# Altium schematic sheet Level Shifting & Connectors.SchDoc
size A4; SheetNumber: 4; SheetTotal: 9
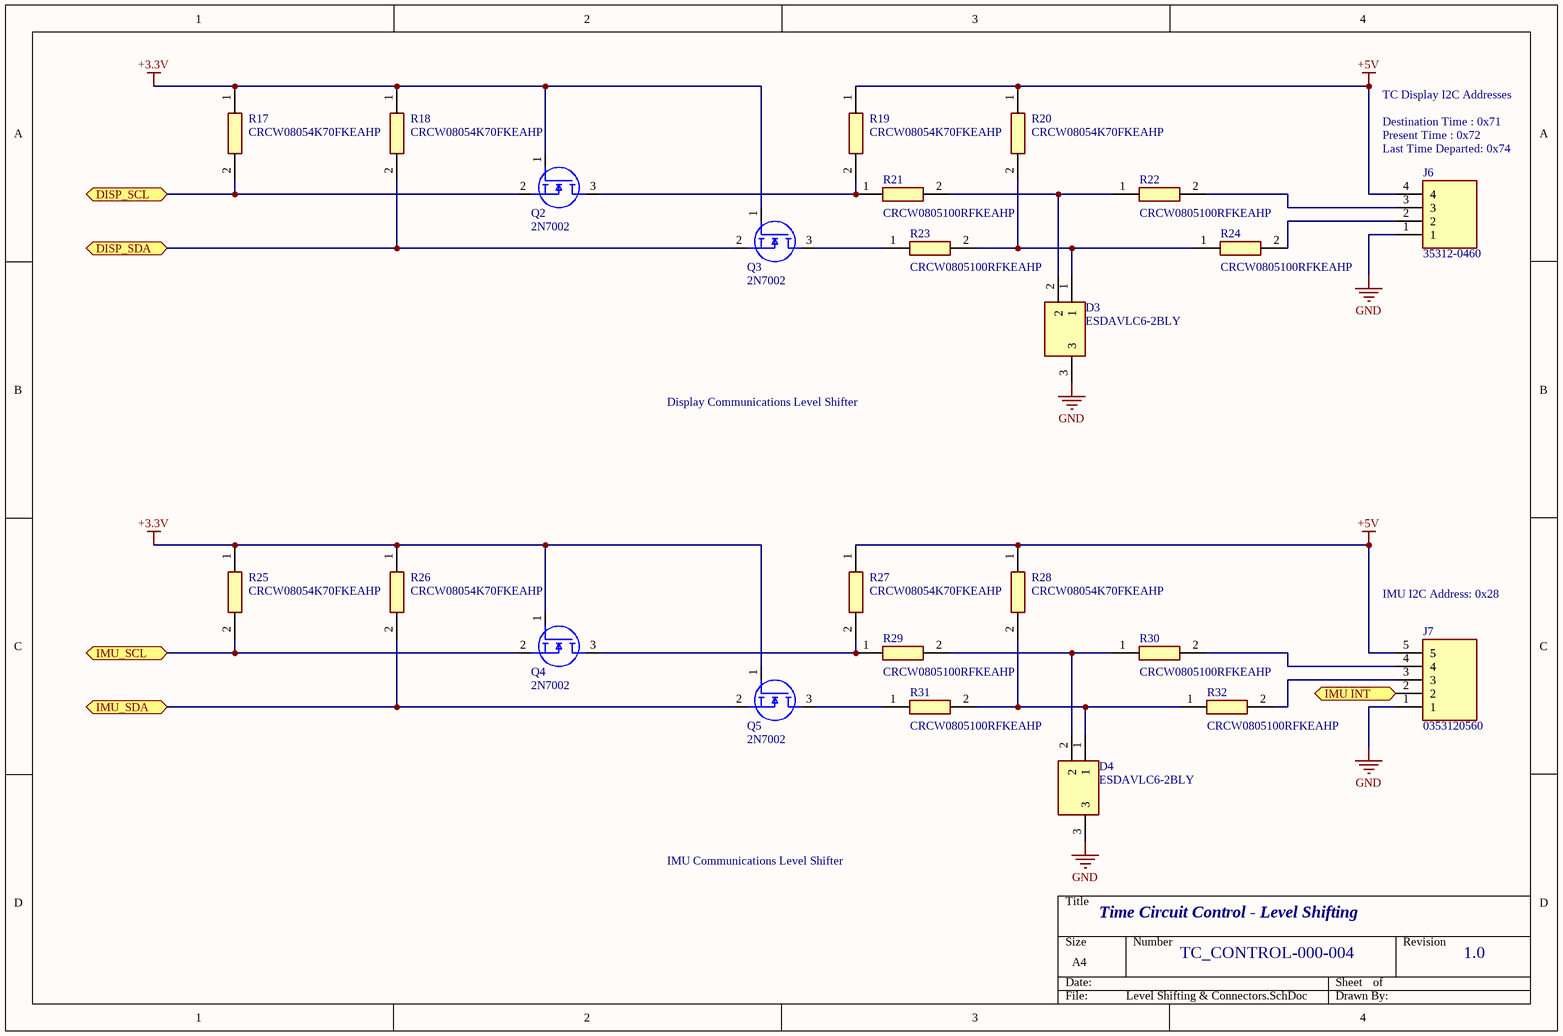
[diagram p0: Level Shifting & Connectors.SchDoc]

## Parts
D3  ESDAVLC6-2BLY  [SOT95P255X150-3N]
D4  ESDAVLC6-2BLY  [SOT95P255X150-3N]
J6  35312-0460  [SHDR4W64P0X250_1X4_1246X650X700P]
J7  0353120560  [0353120560]
Q2  2N7002  [SOT96P240X120-3N]
Q3  2N7002  [SOT96P240X120-3N]
Q4  2N7002  [SOT96P240X120-3N]
Q5  2N7002  [SOT96P240X120-3N]
R17  CRCW08054K70FKEAHP  [RESC2012X50N]
R18  CRCW08054K70FKEAHP  [RESC2012X50N]
R19  CRCW08054K70FKEAHP  [RESC2012X50N]
R20  CRCW08054K70FKEAHP  [RESC2012X50N]
R21  CRCW0805100RFKEAHP  [RESC2012X50N]
R22  CRCW0805100RFKEAHP  [RESC2012X50N]
R23  CRCW0805100RFKEAHP  [RESC2012X50N]
R24  CRCW0805100RFKEAHP  [RESC2012X50N]
R25  CRCW08054K70FKEAHP  [RESC2012X50N]
R26  CRCW08054K70FKEAHP  [RESC2012X50N]
R27  CRCW08054K70FKEAHP  [RESC2012X50N]
R28  CRCW08054K70FKEAHP  [RESC2012X50N]
R29  CRCW0805100RFKEAHP  [RESC2012X50N]
R30  CRCW0805100RFKEAHP  [RESC2012X50N]
R31  CRCW0805100RFKEAHP  [RESC2012X50N]
R32  CRCW0805100RFKEAHP  [RESC2012X50N]

## Ports
DISP_SCL, DISP_SDA, IMU INT, IMU_SCL, IMU_SDA

## Nets
+3.3V: Q2.1(G) Q3.1(G) Q4.1(G) Q5.1(G) R17.1 R18.1 R25.1 R26.1
+5V: J6.4 J7.5 R19.1 R20.1 R27.1 R28.1
GND: D3.3 D4.3 J6.1 J7.1
DISP_SCL: Q2.2(S) R17.2 ; port DISP_SCL
DISP_SDA: Q3.2(S) R18.2 ; port DISP_SDA
IMU INT: J7.2 ; port IMU INT
IMU_SCL: Q4.2(S) R25.2 ; port IMU_SCL
IMU_SDA: Q5.2(S) R26.2 ; port IMU_SDA
NetD3_1: D3.1 R20.2 R23.2 R24.1
NetD3_2: D3.2 R21.2 R22.1
NetD4_1: D4.1 R28.2 R31.2 R32.1
NetD4_2: D4.2 R29.2 R30.1
NetJ6_2: J6.2 R24.2
NetJ6_3: J6.3 R22.2
NetJ7_3: J7.3 R32.2
NetJ7_4: J7.4 R30.2
NetQ2_3: Q2.3(D) R19.2 R21.1
NetQ3_3: Q3.3(D) R23.1
NetQ4_3: Q4.3(D) R27.2 R29.1
NetQ5_3: Q5.3(D) R31.1

## Notes on the sheet
- (near J6) TC Display I2C Addresses
  Destination Time : 0x71
  Present Time : 0x72
  Last Time Departed: 0x74
- Display Communications Level Shifter
- IMU I2C Address: 0x28
- IMU Communications Level Shifter
- Time Circuit Control - Level Shifting
- TC_CONTROL-000-004
- 1.0

## Library data of the parts
D3 D4 = ESDAVLC6-2BLY: TVS Diode (Bi-directional); Manufacturer_Name: STMicroelectronics; Datasheet Link: http://www.st.com/resource/en/datasheet/esdavlc6-2bly.pdf; Height: 1.5mm; Manufacturer_Part_Number: ESDAVLC6-2BLY; Mouser Part Number: 511-ESDAVLC6-2BLY; Mouser Price/Stock: https://www.mouser.co.uk/ProductDetail/STMicroelectronics/ESDAVLC6-2BLY?qs=l7cgNqFNU1iH2e21evvYsA%3D%3D; Arrow Part Number: ESDAVLC6-2BLY; Arrow Price/Stock: https://www.arrow.com/en/products/esdavlc6-2bly/stmicroelectronics
J6 = 35312-0460: Connector; Manufacturer_Name: Molex; Datasheet Link: https://www.molex.com/pdm_docs/sd/353120460_sd.pdf; Height: 7mm; Manufacturer_Part_Number: 35312-0460; Mouser Part Number: 538-35312-0460; Mouser Price/Stock: https://www.mouser.co.uk/ProductDetail/Molex/35312-0460?qs=K5bGVUuM57oIWvCwIBpyrQ%3D%3D
J7 = 0353120560: Connector; Manufacturer_Name: Molex; Datasheet Link: https://www.molex.com/molex/products/part-detail/pcb_headers/0353120560; Height: 7mm; Manufacturer_Part_Number: 0353120560; Mouser Part Number: N/A; Mouser Price/Stock: https://www.mouser.com/Search/Refine.aspx?Keyword=N%2FA; Arrow Part Number: 0353120560; Arrow Price/Stock: https://www.arrow.com/en/products/0353120560/molex
Q2-Q5 = 2N7002: MOSFET (N-Channel); Manufacturer_Name: Vishay; Datasheet Link: https://www.diodes.com/assets/Datasheets/ds11303.pdf; Height: 1.2mm; Manufacturer_Part_Number: 2N7002; Mouser Part Number: 781-2N7002; Mouser Price/Stock: https://www.mouser.co.uk/ProductDetail/Vishay-Siliconix/2N7002?qs=xBpwZ0JX2zKeuvZKtdYLZQ%3D%3D
R17-R20 R25-R28 = CRCW08054K70FKEAHP: Resistor; Manufacturer_Name: Vishay; Datasheet Link: http://uk.rs-online.com/web/p/products/8123574; Height: 0.5mm; Manufacturer_Part_Number: CRCW08054K70FKEAHP; Arrow Part Number: CRCW08054K70FKEAHP; Arrow Price/Stock: https://www.arrow.com/en/products/crcw08054k70fkeahp/vishay; Mouser Part Number: 71-CRCW08054K70FKEAH; Mouser Price/Stock: https://www.mouser.com/Search/Refine.aspx?Keyword=71-CRCW08054K70FKEAH
R21-R24 R29-R32 = CRCW0805100RFKEAHP: Resistor; Manufacturer_Name: Vishay; Datasheet Link: http://uk.rs-online.com/web/p/products/8123362; Height: 0.5mm; Manufacturer_Part_Number: CRCW0805100RFKEAHP; Mouser Part Number: 71-CRCW0805100RFKEAH; Mouser Price/Stock: https://www.mouser.co.uk/ProductDetail/Vishay-Dale/CRCW0805100RFKEAHP?qs=k2%2FDWSARqgHN0DmoUSjg4g%3D%3D; Arrow Part Number: CRCW0805100RFKEAHP; Arrow Price/Stock: https://www.arrow.com/en/products/crcw0805100rfkeahp/vishay?region=nac